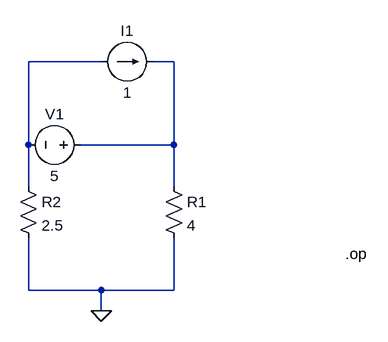
[diagram p0: schematic parallelvoltageandcurrent.asc]
parallelvoltageandcurrent.asc, the LTspice schematic file:
Version 4
SHEET 1 880 680
WIRE 304 64 192 64
WIRE 416 64 384 64
WIRE 192 192 192 64
WIRE 416 192 416 64
WIRE 416 192 272 192
WIRE 192 256 192 192
WIRE 416 256 416 192
WIRE 192 416 192 336
WIRE 304 416 192 416
WIRE 416 416 416 336
WIRE 416 416 304 416
WIRE 304 448 304 416
FLAG 304 448 0
SYMBOL res 400 240 R0
SYMATTR InstName R1
SYMATTR Value 4
SYMBOL res 176 240 R0
SYMATTR InstName R2
SYMATTR Value 2.5
SYMBOL voltage 288 192 R90
WINDOW 0 -32 56 VBottom 2
WINDOW 3 32 56 VTop 2
SYMATTR InstName V1
SYMATTR Value 5
SYMBOL current 304 64 R270
WINDOW 0 32 40 VTop 2
WINDOW 3 -32 40 VBottom 2
SYMATTR InstName I1
SYMATTR Value 1
TEXT 680 360 Left 2 !.op

The netlist it stands for:
* parallelvoltageandcurrent.asc
R1 N002 0 4
R2 N001 0 2.5
V1 N002 N001 5
I1 N001 N002 1
.op
.backanno
.end